# EasyEDA Pro project 2025_06_24_cam.epro

# Schematic Schematic1
Board Name: Board1; Create Date: 2025-06-24; Page Name: P1; Project Name: 2025_06_24_cam; Schematic Name: Schematic1; Update Date: 2025-07-24; Company: EasyEDA.com; Page Size: A4; Version: V1.0
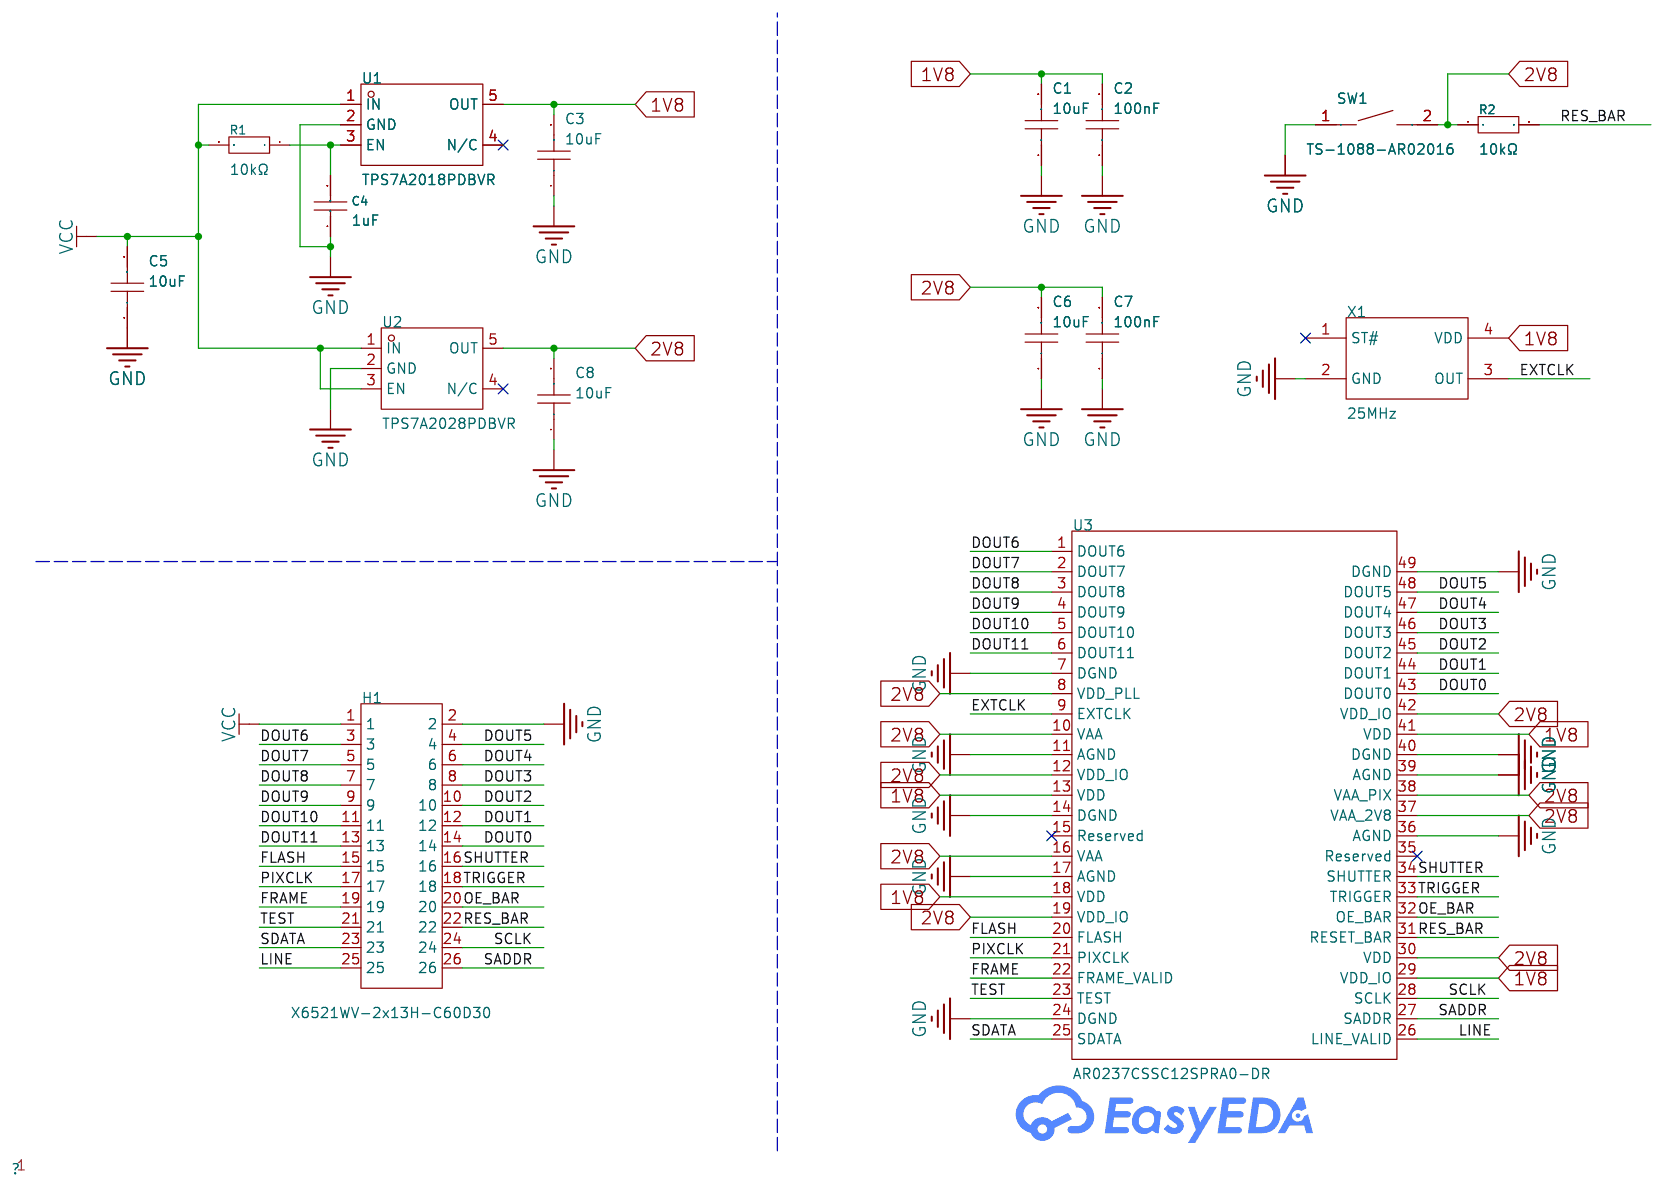
[diagram p0: schematic sheet]

## Parts
C1  10uF  [C0402]
C2  100nF  [C0402]
C3  10uF  [C0402]
C4  1uF  [C0402]
C5  10uF  [C0402]
C6  10uF  [C0402]
C7  100nF  [C0402]
C8  10uF  [C0402]
H1  X6521WV-2x13H-C60D30  [HDR-TH_26P-P2.54-V-M-R2-C13-S2.54]
R1  10kΩ  [R0402]
R2  10kΩ  [R0402]
SW1  TS-1088-AR02016  [SW-SMD_L3.9-W3.0-P4.45]
U1  TPS7A2018PDBVR  [SOT-23-5_L2.9-W1.6-P0.95-LS2.8-BR]
U2  TPS7A2028PDBVR  [SOT-23-5_L2.9-W1.6-P0.95-LS2.8-BR]
U3  AR0237CSSC12SPRA0-DR  [MPLCC-48_L11.4-W11.4-P0.80-TL_AR0237CS]
X1  25MHz  [OSC-SMD_4P-L2.5-W2.0-BL]

## Library data of the parts
C1 C3 C5 C6 C8 = CL05A106MP5NUNC_C315248: Capacitance: Tolerance:±20% Tolerance:±20% Voltage Rated: Temperature Coefficient:; LCSC Part Name: 10uF ±20% 10V; Supplier Part: C315248; Manufacturer: SAMSUNG(三星); Manufacturer Part: CL05A106MP5NUNC; Supplier Footprint: 0402; JLCPCB Part Class: Extended Part; Datasheet: https://atta.szlcsc.com/upload/public/pdf/source/20231220/1EF805BAE1520675928CC4638D279E74.pdf; Supplier: LCSC; Tolerance: ±20%
C2 C7 = CL05B104KO5NNNC: Capacitance: Tolerance:±10% Tolerance:±10% Voltage Rated: Temperature Coefficient:; LCSC Part Name: 100nF ±10% 16V; Supplier Part: C1525; Manufacturer: SAMSUNG(三星); Supplier Footprint: 0402; JLCPCB Part Class: Basic Part; Datasheet: https://atta.szlcsc.com/upload/public/pdf/source/20160218/1457707763339.pdf; Supplier: LCSC; Tolerance: ±10%
C4 = CL05A105KO5NNNC: Capacitance: Tolerance:±10% Tolerance:±10% Voltage Rated: Temperature Coefficient:; LCSC Part Name: 1uF ±10% 16V; Supplier Part: C29266; Manufacturer: SAMSUNG(三星); Supplier Footprint: 0402; JLCPCB Part Class: Extended Part; Datasheet: https://atta.szlcsc.com/upload/public/pdf/source/20160218/1457707763339.pdf; Supplier: LCSC; Tolerance: ±10%
H1 = X6521WV-2x13H-C60D30: Pin Structure:2x13P Pitch:2.54mm Row Spacing:2.54mm Circluar Pins/Square Pins:Policy Number of Rows:Double Row Number of Pins:26P Current Rating:3A Voltage Rating (Max):250V Length of Mating Pin:- Insulation Height:2.5mm Length of End Connection Pin:- Con; LCSC Part Name: 2x13P 间距:2.54mm 方针; Supplier Part: C725885; Manufacturer: XKB Connection(中国星坤); Supplier Footprint: 插件,P=2.54mm; JLCPCB Part Class: Extended Part; Datasheet: https://atta.szlcsc.com/upload/public/pdf/source/20211009/DE33EBA4104B5B447A7BD8383FBBA145.pdf; Supplier: LCSC; Pin Structure: 2x13P; Pitch: 2.54mm; Row Spacing: 2.54mm; Circluar Pins/Square Pins: Policy; Number of Rows: Double Row; Number of Pins: 26P; Current Rating: 3A; Voltage Rating (Max): 250V; Insulation Height: 2.5mm; Contact Material: Brass; Contact Plating: Gold; Operating Temperature: -40℃~+105℃; Color: Black
R1 R2 = 0402WGJ0103TCE: Type:Thick Film Resistors Resistance:10kΩ Tolerance:±5% Tolerance:±5% Power(Watts): Overload Voltage (Max): Temperature Coefficient:±100ppm/℃ Temperature Coefficient:±100ppm/℃ Operating Temperature Range:-55℃~+155℃ Operating Temperature Range:-55℃~+155℃; LCSC Part Name: 10kΩ ±5% 62.5mW 厚膜电阻; Supplier Part: C25531; Manufacturer: UNI-ROYAL(厚声); Supplier Footprint: 0402; Datasheet: https://atta.szlcsc.com/upload/public/pdf/source/20200306/C422600_1E6D84923E4A46A82E41ADD87F860B5C.pdf; Supplier: LCSC; Type: Thick Film Resistors; Tolerance: ±5%; Temperature Coefficient: ±100ppm/℃; Operating Temperature Range: -55℃~+155℃
SW1 = TS-1088-AR02016: Circuit:SPST Actuator Style:Round Button Operating Force:160gf Mounting Style:Brick nogging Switch Length:4mm Switch Width:3mm Switch Height:2mm Strike Gundam:不带 Contact Current:50mA Voltage Rating (DC):12V Insulation Resistance:100MΩ Actuator/Cap Color:B; LCSC Part Name: 4*3*2mm 立贴 轻触开关; Supplier Part: C720477; Manufacturer: XUNPU(讯普); Supplier Footprint: SMD; JLCPCB Part Class: Basic Part; Datasheet: https://atta.szlcsc.com/upload/public/pdf/source/20200810/C720475_60D09DD6C54279ADDB2DC25100F1CC11.pdf; Supplier: LCSC; Circuit: SPST; Actuator Style: Round Button; Operating Force: 160gf; Mounting Style: Brick nogging; Switch Length: 4mm; Switch Width: 3mm; Switch Height: 2mm; Strike Gundam: 不带; Contact Current: 50mA; Voltage Rating (DC): 12V; Insulation Resistance: 100MΩ; Actuator/Cap Color: Black; Pin Style: SMDSplicing; Mechanical Life: 10万次; Operating Temperature: -30℃~+80℃
U1 = TPS7A2018PDBVR: Output Type:Fixed Maximum Input Voltage:6V Output Voltage:1.8V Output Voltage:1.8V Output Current:300mA Dropout Voltage:200mV@(300mA) standby current:15uA Feature:ESD Protection；Soft Start；Surge Protection；Low ESR；Thermal Protection(TSD)；Under-voltage Loc; LCSC Part Name: 具有高 PSRR 的 300mA、超低噪声、低 IQ、低压降 (LDO) 线性稳压器; Supplier Part: C963430; Manufacturer: TI(德州仪器); Supplier Footprint: SOT-23-5L; JLCPCB Part Class: Extended Part; Datasheet: https://www.ti.com/cn/lit/gpn/tps7a20; Supplier: LCSC; Output Type: Fixed; Maximum Input Voltage: 6V; Output Voltage: 1.8V; Output Current: 300mA; Dropout Voltage: 200mV@(300mA); standby current: 15uA; Feature: ESD Protection；Soft Start；Surge Protection；Low ESR；Thermal Protection(TSD)；Under-voltage Lockout；Overcurrent Protection(OCP)；With ability；Anti-Siphon; Operating Temperature: -40℃~+125℃@(Tj); Output Polarity: Positive electrode; Number of Outputs: 1
U2 = TPS7A2028PDBVR: Output Type:Fixed Maximum Input Voltage:6V Output Voltage:2.8V Output Voltage:2.8V Output Current:300mA Dropout Voltage:140mV@(300mA) standby current:15uA Feature:防静电保护；Soft Start；浪涌保护；低ESR；Thermal Protection(TSD)；欠压闭锁；Overcurrent Protection(OCP)；带使能；防倒灌; LCSC Part Name: 具有高 PSRR 的 300mA、超低噪声、低 IQ、低压降 (LDO) 线性稳压器; Supplier Part: C2869847; Manufacturer: TI(德州仪器); Supplier Footprint: SOT-23-5; JLCPCB Part Class: Extended Part; Datasheet: https://www.ti.com/cn/lit/gpn/tps7a20; Supplier: LCSC; Output Type: Fixed; Maximum Input Voltage: 6V; Output Voltage: 2.8V; Output Current: 300mA; Dropout Voltage: 140mV@(300mA); standby current: 15uA; Feature: 防静电保护；Soft Start；浪涌保护；低ESR；Thermal Protection(TSD)；欠压闭锁；Overcurrent Protection(OCP)；带使能；防倒灌; Operating Temperature: -40℃~+125℃@(Tj); Output Polarity: Positive electrode; Number of Outputs: 1
U3 = AR0237CSSC12SPRA0-DR: Sensor Type:CMOS Image Sensor Active Pixel Array:1920Hx1080V Pixel Size:3umx3um Operating Temperature:-30℃~+85℃ Operating Temperature:-30℃~+85℃; Supplier Part: C900569; Manufacturer: onsemi(安森美); Supplier Footprint: PLCC-48(11.4x11.4); JLCPCB Part Class: Extended Part; Datasheet: https://atta.szlcsc.com/upload/public/pdf/source/20241023/90BE99652C66EF00899882826D8CE264.pdf; Supplier: LCSC; Sensor Type: CMOS Image Sensor; Active Pixel Array: 1920Hx1080V; Pixel Size: 3umx3um; Operating Temperature: -30℃~+85℃
X1 = X1G0041710033: Frequency:25MHz Normal temperature Frequency Tolerance:±50ppm Normal temperature Frequency Tolerance:±50ppm Output Type:CMOS Voltage - Supply:1.62V~3.63V Voltage - Supply:1.62V~3.63V Current - Supply:2.2mA Frequency Stability:- Frequency Stability:- Opera; LCSC Part Name: X1G004171003300; Supplier Part: C70560; Manufacturer: EPSON(爱普生); Supplier Footprint: SMD2520-4P; JLCPCB Part Class: Extended Part; Datasheet: https://atta.szlcsc.com/upload/public/pdf/source/20240417/409BB86F0D6309121A7CCAFE0166E1CF.pdf; Supplier: LCSC; Normal temperature Frequency Tolerance: ±50ppm; Output Type: CMOS; Voltage - Supply: 1.62V~3.63V; Current - Supply: 2.2mA; Operating Temperature: -40℃~+85℃

## Nets
1V8: C1.2 C2.2 C3.2 U1.5(OUT) U3.13(VDD) U3.18(VDD) U3.29(VDD_IO) U3.41(VDD) X1.4(VDD)
2V8: C6.2 C7.2 C8.2 R2.1 SW1.2 U2.5(OUT) U3.8(VDD_PLL) U3.10(VAA) U3.12(VDD_IO) U3.16(VAA) U3.19(VDD_IO) U3.30(VDD) U3.37(VAA_2V8) U3.38(VAA_PIX) U3.42(VDD_IO)
GND: C1.1 C2.1 C3.1 C4.1 C5.1 C6.1 C7.1 C8.1 H1.2 SW1.1 U1.2(GND) U2.2(GND) U3.7(DGND) U3.11(AGND) U3.14(DGND) U3.17(AGND) U3.24(DGND) U3.36(AGND) U3.39(AGND) U3.40(DGND) U3.49(DGND) X1.2(GND)
VCC: C5.2 H1.1 R1.2 U1.1(IN) U2.1(IN) U2.3(EN)
DOUT0: H1.14 U3.43(DOUT0)
DOUT1: H1.12 U3.44(DOUT1)
DOUT2: H1.10 U3.45(DOUT2)
DOUT3: H1.8 U3.46(DOUT3)
DOUT4: H1.6 U3.47(DOUT4)
DOUT5: H1.4 U3.48(DOUT5)
DOUT6: H1.3 U3.1(DOUT6)
DOUT7: H1.5 U3.2(DOUT7)
DOUT8: H1.7 U3.3(DOUT8)
DOUT9: H1.9 U3.4(DOUT9)
DOUT10: H1.11 U3.5(DOUT10)
DOUT11: H1.13 U3.6(DOUT11)
EXTCLK: U3.9(EXTCLK) X1.3(OUT)
FLASH: H1.15 U3.20(FLASH)
FRAME: H1.19 U3.22(FRAME_VALID)
LINE: H1.25 U3.26(LINE_VALID)
OE_BAR: H1.20 U3.32(OE_BAR)
PIXCLK: H1.17 U3.21(PIXCLK)
RES_BAR: H1.22 R2.2 U3.31(RESET_BAR)
SADDR: H1.26 U3.27(SADDR)
SCLK: H1.24 U3.28(SCLK)
SDATA: H1.23 U3.25(SDATA)
SHUTTER: H1.16 U3.34(SHUTTER)
TEST: H1.21 U3.23(TEST)
TRIGGER: H1.18 U3.33(TRIGGER)
$1N8924: C4.2 R1.1 U1.3(EN)

Not connected (* = marked no-connect by the designer): U1 4(N/C)*; U2 4(N/C)*; U3 15(Reserved)* 35(Reserved)*; X1 1(ST#)*

# Board PCB1
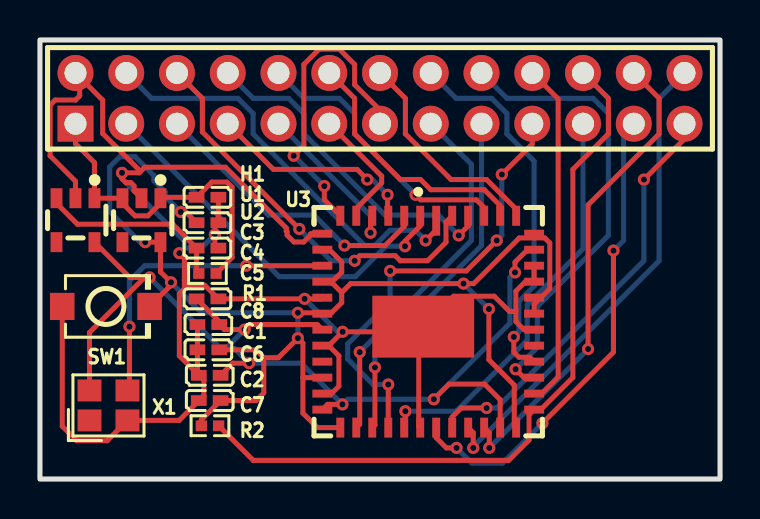
[diagram p1: board, top side]
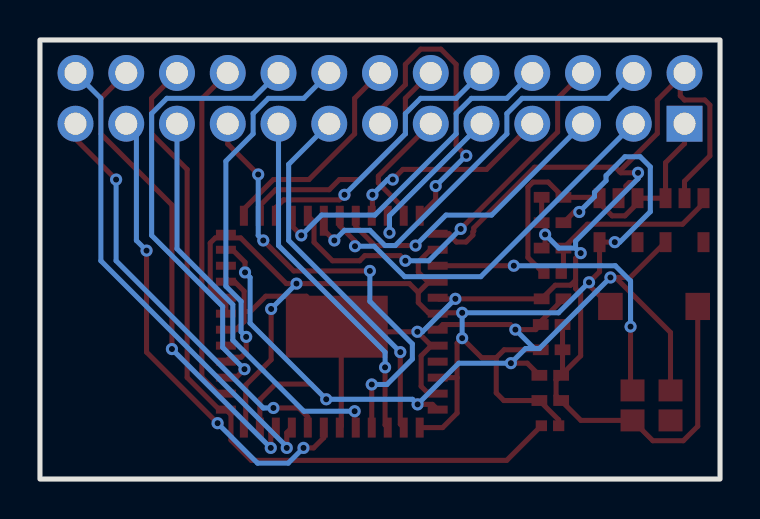
[diagram p2: board, bottom side, seen from below]

Outline 34.04 x 21.97 mm; copper layers: Top Layer, Bottom Layer. Coordinates in mm from the lower left corner of the outline.
Outline path: rectangle 0,21.97 34.04,0
Stack: Top Layer 0.035mm / Dielectric1 1.51mm FR4 er 4.5 / Bottom Layer 0.035mm

## Design rules (mm)
template: JLCPCB Capability(Two Layers Board)
spacing copperThickness1oz (default): track to track 0.102, other pairs 0.152 to 0.3
spacing copperThickness2oz: track to track 0.203, other pairs 0.152 to 0.3
track width copperThickness1oz (default): min 0.127, default 0.254, max 2.54
track width copperThickness2oz: min 0.203, default 0.254, max 2.54
differential pair differentialPair (default): width min 0.127, default 0.254, max 2.54; gap min 0.152, default 0.152
via viaSize (default): diameter min 0.5, default 0.61, max 10; hole min 0.3, default 0.305, max 6.3

## Placement (name value [footprint] x y rotation side)
C1  10uF  [C0402]  8.43 7.73 0 top
C2  100nF  [C0402]  8.5 5.19 0 top
C3  10uF  [C0402]  8.38 9.02 180 top
C4  1uF  [C0402]  8.38 11.56 180 top
C5  10uF  [C0402]  8.38 14.1 180 top
C6  10uF  [C0402]  8.43 6.47 0 top
C7  100nF  [C0402]  8.5 3.93 0 top
C8  10uF  [C0402]  8.38 12.83 180 top
H1  X6521WV-2x13H-C60D30  [HDR-TH_26P-P2.54-V-M-R2-C13-S2.54]  17.02 19.05 0 top
R1  10kΩ  [R0402]  8.38 10.29 0 top
R2  10kΩ  [R0402]  8.51 2.67 0 top
SW1  TS-1088-AR02016  [SW-SMD_L3.9-W3.0-P4.45]  3.3 8.64 0 top
U1  TPS7A2018PDBVR  [SOT-23-5_L2.9-W1.6-P0.95-LS2.8-BR]  1.78 12.95 90 top
U2  TPS7A2028PDBVR  [SOT-23-5_L2.9-W1.6-P0.95-LS2.8-BR]  5.08 12.95 90 top
U3  AR0237CSSC12SPRA0-DR  [MPLCC-48_L11.4-W11.4-P0.80-TL_AR0237CS]  19.43 7.87 0 top
X1  25MHz  [OSC-SMD_4P-L2.5-W2.0-BL]  3.43 3.68 0 top

## Footprints (pads in the part's own frame, mm; a bottom-side part is the same pattern mirrored in y, then rotated)
C0402
  rect 0.79x0.54 smd: 1(-0.545,0) 2(0.545,0)
HDR-TH_26P-P2.54-V-M-R2-C13-S2.54
  rect 1.8x1.8 hole 1.1: 1(-15.24,-1.27)
  round 1.8 hole 1.1: 2(-15.24,1.27) 3(-12.7,-1.27) 4(-12.7,1.27) 5(-10.16,-1.27) 6(-10.16,1.27) 7(-7.62,-1.27) 8(-7.62,1.27) 9(-5.08,-1.27) 10(-5.08,1.27) 11(-2.54,-1.27) 12(-2.54,1.27) 13(0,-1.27) 14(0,1.27) 15(2.54,-1.27) 16(2.54,1.27) 17(5.08,-1.27) 18(5.08,1.27) 19(7.62,-1.27) 20(7.62,1.27) 21(10.16,-1.27) 22(10.16,1.27) 23(12.7,-1.27) 24(12.7,1.27) 25(15.24,-1.27) 26(15.24,1.27)
MPLCC-48_L11.4-W11.4-P0.80-TL_AR0237CS
  rect 0.4x1 smd: 1(-0.4,5.3) 2(-1.2,5.3) 3(-2,5.3) 4(-2.8,5.3) 5(-3.6,5.3) 6(-4.4,5.3) 19(-4.4,-5.3) 20(-3.6,-5.3) 21(-2.8,-5.3) 22(-2,-5.3) 23(-1.2,-5.3) 24(-0.4,-5.3) 25(0.4,-5.3) 26(1.2,-5.3) 27(2,-5.3) 28(2.8,-5.3) 29(3.6,-5.3) 30(4.4,-5.3) 43(4.4,5.3) 44(3.6,5.3) 45(2.8,5.3) 46(2,5.3) 47(1.2,5.3)
  rect 1x0.4 smd: 7(-5.3,4.4) 8(-5.3,3.6) 9(-5.3,2.8) 10(-5.3,2.001) 11(-5.3,1.2) 12(-5.3,0.4) 13(-5.3,-0.4) 14(-5.3,-1.2) 15(-5.3,-2) 16(-5.3,-2.8) 17(-5.3,-3.6) 18(-5.3,-4.4) 31(5.3,-4.4) 32(5.3,-3.6) 33(5.3,-2.8) 34(5.3,-2) 35(5.3,-1.2) 36(5.3,-0.4) 37(5.3,0.4) 38(5.3,1.2) 39(5.3,2.001) 40(5.3,2.8) 41(5.3,3.6) 42(5.3,4.4)
  rect 0.4x1.5 smd: 48(0.4,5.05)
  rect 5.1x3.1 smd: 49(-0.25,-0.25)
OSC-SMD_4P-L2.5-W2.0-BL
  rect 1.2x1.1 smd: 1(-0.95,-0.75) 2(0.95,-0.75) 3(0.95,0.75) 4(-0.95,0.75)
R0402
  rect 0.566x0.54 smd: 1(-0.433,0) 2(0.433,0)
SOT-23-5_L2.9-W1.6-P0.95-LS2.8-BR
  rect 1x0.6 smd: 1(1.1,-0.95) 2(1.1,0) 3(1.1,0.95) 4(-1.1,0.95) 5(-1.1,-0.95)
SW-SMD_L3.9-W3.0-P4.45
  rect 1.23x1.36 smd: 1(-2.185,0) 2(2.185,0)

## Nets
As in the schematic.

Pads without a net: U1 4; U2 4; U3 15 35; X1 1

## Via types
v1: diameter 0.61, hole 0.305, Top Layer to Bottom Layer, 49 vias

## Routing (per net, layer and track width the routed paths; a pad name or vN(x,y) marks a point on that pad's centre or on a via; arc(x,y) is an arc through that point)
1V8: length 53.7
  Top Layer w0.254: 7.84,9.02 8.97,7.88 C1.2 9.23,7.48 v1(10.24,7.48) 10.5,7.73 13.87,7.73 U3.13 ; v1(10.47,5.8) 9.65,5.8 C2.2 ; U3.29 23.03,3.97 22.25,4.75 20.47,4.75 v1(19.71,3.99) ; v1(23.77,10.34) 23.77,10.85 24.4,11.47 U3.41 ; 5.23,10.09 2.48,7.33 X1.4 ; 5.23,10.09 v1(5.49,10.09) ; 5.23,10.09 4.5,10.09 U1.5 ; v1(15.14,3.74) 14.39,3.74 U3.18
  Bottom Layer w0.254: 9.3,6.53 9.74,6.53 v1(10.47,5.8) 13.08,5.8 v1(15.14,3.74) 15.39,3.99 v1(19.71,3.99) 23.52,7.8 23.52,10.09 v1(23.77,10.34) ; 9.3,6.53 v1(10.24,7.48) ; 9.3,6.53 9.04,6.53 v1(5.49,10.09)
2V8: length 71.9
  Top Layer w0.254: U3.8 14.49,11.47 15.1,10.86 15.1,10.35 14.59,9.84 ; C6.2 10.8,6.47 11.2,6.07 ; 15.1,9.34 14.59,9.84 ; 15.1,9.34 15.55,9.78 v1(21.2,9.78) 21.71,9.78 23.99,12.07 24.75,12.07 ; 15.1,9.34 15.1,8.83 14.59,8.32 14.09,8.32 ; 14.59,9.84 14.16,9.84 U3.10 ; R2.1 8.08,2.96 C7.2 10.82,3.93 11.2,4.31 11.2,6.07 ; 14.09,8.32 U3.12 ; 14.09,8.32 v1(12.91,8.32) ; 24.75,12.07 U3.42 ; 24.75,12.07 25.26,12.07 25.52,11.81 25.52,9.53 25.01,9.02 ; U3.30 23.74,2.67 23.74,4.7 22.47,5.97 v1(22.47,8.51) ; 11.2,6.07 11.93,6.07 v1(12.91,7.05) 13.16,6.8 13.16,5.07 ; SW1.2 6.56,9.71 v1(6.56,9.84) 6.03,10.37 U2.5 v1(5.27,11.85) ; 13.16,5.07 13.16,3.3 13.88,2.57 U3.19 ; 13.16,5.07 U3.16 ; v1(7.05,13.36) 7.3,13.36 7.84,12.83 ; 25.01,9.02 24.79,9.02 U3.38 ; 25.01,9.02 24.73,8.74 U3.37
  Bottom Layer w0.254: v1(6.56,9.84) 8.08,8.32 v1(12.91,8.32) v1(12.91,7.05) ; v1(5.27,11.85) 5.01,11.85 3.49,13.38 3.49,15.62 4,16.13 4.76,16.13 5.7,15.18 5.7,14.93 6.28,14.35 6.28,14.13 v1(7.05,13.36) ; v1(21.2,9.78) v1(22.47,8.51)
GND: length 96.3
  Top Layer w0.254: 18.96,7.62 17.94,7.62 17.69,7.37 v1(15.15,7.37) 14.45,6.67 ; 18.96,7.62 18.96,2.65 U3.24 ; 18.96,7.62 U3.49 20.71,9.15 22.74,9.15 23.5,8.39 23.82,8.39 ; 23.82,8.39 23.82,9.4 24.29,9.87 U3.39 U3.40 ; 23.82,8.39 23.82,7.88 24.22,7.47 U3.36 ; 1.99,20.11 3.14,18.96 3.14,17.29 5.04,15.39 ; 1.99,20.11 1.99,19.18 1.78,18.97 0.76,18.97 0.51,18.71 0.51,16.17 1.78,14.9 U1.2 ; 1.99,20.11 H1.2 ; SW1.1 1.12,2.64 1.84,1.92 3.36,1.92 X1.2 6.96,2.93 7.96,3.93 ; C4.1 8.75,11.73 v1(8.75,12.24) 8.75,12.65 C8.1 C5.1 ; U3.11 14.07,9.02 v1(13.25,9.02) C3.1 8.25,9.7 7.48,9.7 7.23,9.95 ; 7.96,3.93 C7.1 ; 7.96,3.93 8.21,4.17 8.21,4.94 C2.1 7.88,5.26 ; U3.17 14.59,4.27 14.96,4.64 14.96,6.17 14.45,6.67 ; 5.04,15.39 4.97,15.32 v1(4.1,15.32) 4.1,15.03 4.3,14.83 4.55,14.83 4.71,14.67 4.71,14.42 U2.2 ; 5.04,15.39 5.25,15.6 9.28,15.6 12.32,12.56 12.32,12.41 12.37,12.37 12.37,12.2 12.71,11.86 13.2,11.86 13.54,12.2 13.54,12.25 13.56,12.27 U3.7 ; v1(6.98,11.3) 7.23,11.05 7.23,9.95 ; 7.23,9.95 7.23,9.53 6.98,9.27 6.98,6.17 7.88,5.26 ; 7.88,5.26 C6.1 C1.1 ; 14.45,6.67 U3.14
  Bottom Layer w0.254: 7.23,11.56 8.07,11.56 v1(8.75,12.24) ; 7.23,11.56 7.23,11.91 4.1,15.03 v1(4.1,15.32) ; 7.23,11.56 v1(6.98,11.3) ; v1(15.15,7.37) 14.89,7.37 v1(13.25,9.02)
VCC: length 17.1
  Top Layer w0.254: H1.1 1.78,16.78 2.73,15.83 U1.1 U2.3 4.25,13.93 4.25,13.68 4.76,13.17 5.4,13.17 6.03,13.8 U2.1 6.07,14.1 7.84,14.1 8.6,14.86 9.36,14.86 9.62,14.61 9.62,11.09 R1.2
DOUT0: length 11
  Top Layer w0.254: U3.43 23.83,13.51 22.35,14.99 20.57,14.99 18.29,17.27 18.29,19.05 H1.14
DOUT1: length 12.9
  Top Layer w0.254: U3.44 23.03,13.68 22.24,14.48 19.56,14.48 19.05,14.99 18.03,14.99 15.75,17.27 15.75,19.05 H1.12
DOUT2: length 14.1
  Top Layer w0.254: v1(18.8,14.22) 19.05,13.97 21.84,13.97 22.23,13.58 U3.45
  Bottom Layer w0.254: v1(18.8,14.22) 15.75,17.27 15.75,18.29 14.99,19.05 13.21,19.05 H1.10
DOUT3: length 16.7
  Top Layer w0.254: U3.46 21.43,12.67 v1(20.96,12.19)
  Bottom Layer w0.254: v1(20.96,12.19) 19.94,13.21 17.27,13.21 13.21,17.27 13.21,18.29 12.45,19.05 10.67,19.05 H1.8
DOUT4: length 20.4
  Top Layer w0.254: v1(12.98,12.52) 8.13,17.37 8.13,19.05 H1.6 ; U3.47 20.32,12.86 20.32,11.85 19.4,10.92 18.03,10.92 17.78,11.18 16,11.18 v1(15.75,10.92)
  Bottom Layer w0.254: v1(15.75,10.92) 14.57,10.92 v1(12.98,12.52)
DOUT5: length 20.9
  Top Layer w0.254: U3.48 19.83,12.47 v1(19.3,11.94)
  Bottom Layer w0.254: H1.4 5.59,19.05 9.91,19.05 10.67,18.29 10.67,17.27 16.26,11.68 16.76,11.68 17.53,12.45 18.8,12.45 v1(19.3,11.94)
DOUT6: length 19.6
  Top Layer w0.254: U3.1 19.03,12.67 18.27,11.9 v1(18.27,11.65)
  Bottom Layer w0.254: v1(18.27,11.65) 17.31,11.65 15.78,10.13 11.97,10.13 H1.3
DOUT7: length 14.8
  Top Layer w0.254: v1(15.24,11.68) 17.27,11.68 18.23,12.64 U3.2
  Bottom Layer w0.254: H1.5 11.43,13.21 13.72,13.21 v1(15.24,11.68)
DOUT8: length 10.5
  Top Layer w0.254: v1(16.38,14.99) 15.87,15.49 11.68,15.49 H1.7 ; v1(17.4,14.22) 17.4,13.21 U3.3
  Bottom Layer w0.254: v1(16.38,14.99) 16.63,14.99 v1(17.4,14.22)
DOUT9: length 8.2
  Top Layer w0.254: v1(16.54,12.33) 16.54,13.09 U3.4
  Bottom Layer w0.254: H1.9 16.54,13.17 v1(16.54,12.33)
DOUT10: length 6.2
  Top Layer w0.254: U3.5 15.83,13.55 17.1,14.81 17.1,15.16 H1.11
DOUT11: length 15.4
  Top Layer w0.254: v1(12.7,16.18) 13.21,16.69 13.21,20.75 13.97,21.51 14.99,21.51 15.75,20.75 15.75,19.73 17.02,18.46 H1.13 ; v1(14.23,14.66) 14.23,13.97 U3.6
  Bottom Layer w0.254: v1(14.23,14.66) 12.72,16.18 v1(12.7,16.18)
EXTCLK: length 15.5
  Top Layer w0.254: U3.9 v1(10.32,10.67) ; v1(4.48,7.63) 4.48,4.53 X1.3
  Bottom Layer w0.254: v1(10.32,10.67) 5.24,10.67 4.48,9.91 v1(4.48,7.63)
FLASH: length 18.4
  Top Layer w0.254: v1(16,6.35) 16,2.75 U3.20
  Bottom Layer w0.254: H1.15 21.59,15.75 21.59,11.94 v1(16,6.35)
FRAME: length 22.6
  Top Layer w0.254: H1.19 24.64,16.76 v1(23.11,15.24) ; v1(22.86,11.94) 21.34,10.41 v1(17.53,10.41) ; v1(17.43,4.73) U3.22
  Bottom Layer w0.254: v1(17.53,10.41) 17.53,8.89 15.4,6.76 15.4,6 16.67,4.73 v1(17.43,4.73) ; v1(23.11,15.24) 23.11,12.19 v1(22.86,11.94)
LINE: length 21.1
  Top Layer w0.254: v1(22.35,3.56) 21.08,3.56 20.63,3.11 U3.26 ; H1.25 32.26,17.02 v1(30.23,14.99)
  Bottom Layer w0.254: v1(30.23,14.99) 30.23,10.92 22.86,3.56 v1(22.35,3.56)
OE_BAR: length 17.3
  Top Layer w0.254: U3.32 25.1,4.27 25.93,5.11 25.93,19.02 H1.20
PIXCLK: length 17.5
  Top Layer w0.254: U3.21 16.76,2.71 v1(16.76,5.59)
  Bottom Layer w0.254: v1(16.76,5.59) 16.76,6.35 22.1,11.68 H1.17
RES_BAR: length 37.4
  Top Layer w0.254: H1.22 28.45,19.05 28.45,17.27 26.67,15.49 26.67,5.08 25.06,3.47 U3.31 24.48,3.22 24.48,1.95 23.46,0.93 10.67,0.93 R2.2
SADDR: length 24.3
  Top Layer w0.254: U3.27 21.69,2.32 v1(21.69,1.56)
  Bottom Layer w0.254: H1.26 30.99,19.05 30.99,10.92 21.69,1.62 v1(21.69,1.56)
SCLK: length 23.9
  Top Layer w0.254: H1.24 30.99,19.05 30.99,17.27 27.43,13.72 v1(27.43,6.51) ; U3.28 22.49,2.32 v1(22.49,1.56)
  Bottom Layer w0.254: v1(27.43,6.51) v1(22.49,1.56)
SDATA: length 24.1
  Top Layer w0.254: v1(20.85,1.56) 20.34,1.56 19.83,2.07 U3.25 ; v1(25.15,2.79) 28.7,6.35 v1(28.7,11.43)
  Bottom Layer w0.254: v1(25.15,2.79) 23.15,0.8 21.61,0.8 v1(20.85,1.56) ; v1(28.7,11.43) 29.21,11.94 29.21,17.27 H1.23
SHUTTER: length 18.8
  Top Layer w0.254: U3.34 24.51,6.1 23.97,6.1 23.72,6.35 v1(23.72,7.11)
  Bottom Layer w0.254: H1.16 20.83,19.05 22.61,19.05 23.37,18.29 23.37,17.27 24.73,15.91 24.73,9.65 23.97,8.89 23.97,7.37 v1(23.72,7.11)
TEST: length 20.4
  Top Layer w0.254: U3.23 18.29,2.63 v1(18.29,3.39)
  Bottom Layer w0.254: H1.21 27.18,11.52 24.38,8.73 24.38,6.95 20.83,3.39 v1(18.29,3.39)
TRIGGER: length 23
  Top Layer w0.254: v1(23.8,5.5) 24.22,5.07 U3.33
  Bottom Layer w0.254: v1(23.8,5.5) 24.89,6.59 24.89,8.64 28.45,12.19 28.45,18.29 27.69,19.05 23.37,19.05 H1.18
$1N8924: length 9.5
  Top Layer w0.254: R1.1 7.84,10.4 7.84,11.56 6.64,12.75 1.88,12.75 0.83,13.8 U1.3
